# Altium project ESP32-Sense Kit Motherboard.PrjPcb
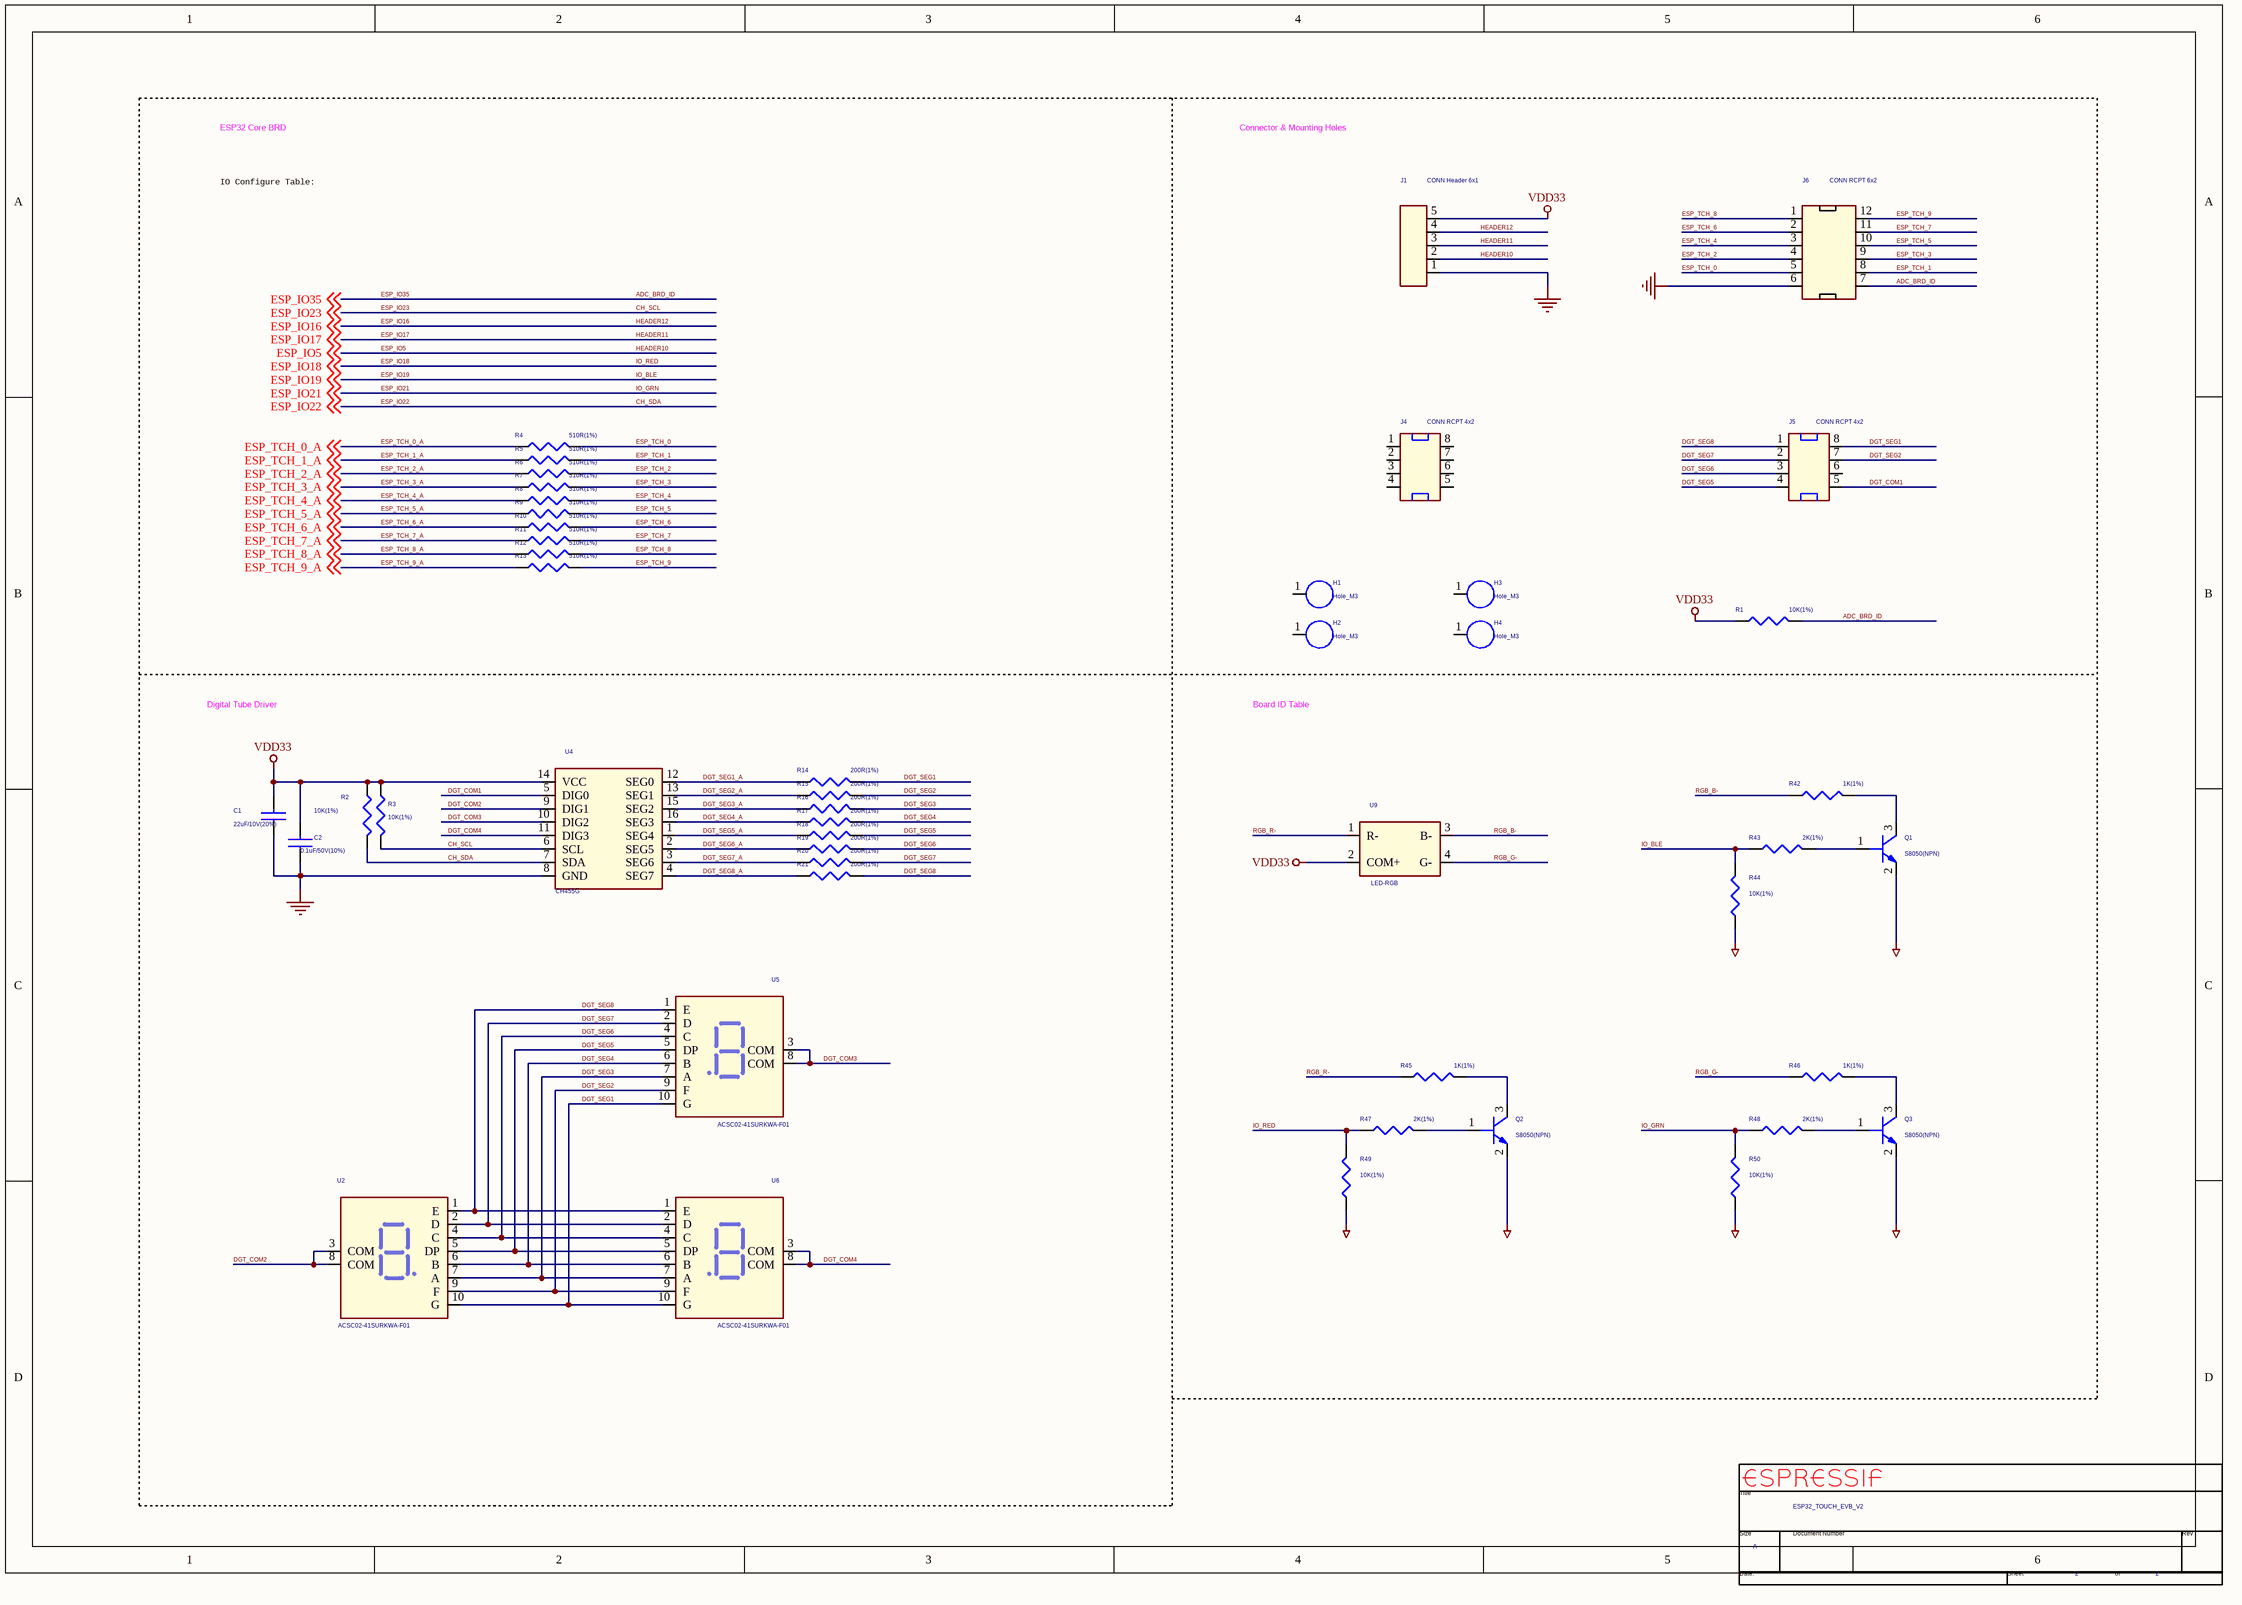
[diagram p0: 02 ESP32 MAIN_B.SchDoc]
2 sheets, 72 parts. Net scope: global (net labels, ports and power ports of the same name join across sheets).
Board file: ESP32-Sense Kit Motherboard.PcbDoc
Sheets:
  02 ESP32 MAIN_B.SchDoc
  01 ESP32 MAIN_A.SchDoc

## Sheet 02 ESP32 MAIN_B.SchDoc
size 420 x 297 mm

### Parts
(Parts that share a designator on the sheet are numbered #1, #2 ... from top to bottom, then left to right.)
*#1  Title: ESP32_TOUCH_EVB_V2  Page Size: A  Page Number: 2  (hidden comment: espTitleBlock1)  (graphical)
C1  22uF/10V(20%)  [0603C]
C2  0.1uF/50V(10%)  [0402C]
H1  Hole_M3  [MTGH200C125D-N]
H2  Hole_M3  [MTGH200C125D-N]
H3  Hole_M3  [MTGH200C125D-N]
H4  Hole_M3  [MTGH200C125D-N]
J1  CONN Header 6x1  [CON_5x1_2P54]
J4  CONN RCPT 4x2  [CON_F_4x2_2P00]
J5  CONN RCPT 4x2  [CON_F_4x2_2P00]
J6  CONN RCPT 6x2  [CON_F_6x2_2P00]
Q1  S8050(NPN)  [SOT-23-3]
Q2  S8050(NPN)  [SOT-23-3]
Q3  S8050(NPN)  [SOT-23-3]
R1  10K(1%)  [0402R]
R2  10K(1%)  [0402R]
R3  10K(1%)  [0402R]
R4  510R(1%)  [0402R]
R5  510R(1%)  [0402R]
R6  510R(1%)  [0402R]
R7  510R(1%)  [0402R]
R8  510R(1%)  [0402R]
R9  510R(1%)  [0402R]
R10  510R(1%)  [0402R]
R11  510R(1%)  [0402R]
R12  510R(1%)  [0402R]
R13  510R(1%)  [0402R]
R14  200R(1%)  [0402R]
R15  200R(1%)  [0402R]
R16  200R(1%)  [0402R]
R17  200R(1%)  [0402R]
R18  200R(1%)  [0402R]
R19  200R(1%)  [0402R]
R20  200R(1%)  [0402R]
R21  200R(1%)  [0402R]
R42  1K(1%)  [0402R]
R43  2K(1%)  [0402R]
R44  10K(1%)  [0402R]
R45  1K(1%)  [0402R]
R46  1K(1%)  [0402R]
R47  2K(1%)  [0402R]
R48  2K(1%)  [0402R]
R49  10K(1%)  [0402R]
R50  10K(1%)  [0402R]
U2  ACSC02-41SURKWA-F01  [DG10069]
U4  CH455G  [SOP16-150MIL]
U5  ACSC02-41SURKWA-F01  [DG10069]
U6  ACSC02-41SURKWA-F01  [DG10069]
U9  LED-RGB  [LED3528]

### Nets
GND: C1.1 C2.1 J1.1 J6.6 Q1.2(E) Q2.2(E) Q3.2(E) R44.1 R49.1 R50.1 U4.8(GND)
VDD33: C1.2 C2.2 J1.5 R1.1 R2.1 R3.1 U4.14(VCC) U9.2(COM+)
ADC_BRD_ID: J6.7 R1.2 ; off-sheet ESP_IO35  [also labelled ESP_IO35]
CH_SCL: R3.2 U4.6(SCL) ; off-sheet ESP_IO23  [also labelled ESP_IO23]
CH_SDA: R2.2 U4.7(SDA) ; off-sheet ESP_IO22  [also labelled ESP_IO22]
DGT_COM1: J5.5 U4.5(DIG0)
DGT_COM2: U2.3(COM) U2.8(COM) U4.9(DIG1)
DGT_COM3: U4.10(DIG2) U5.3(COM) U5.8(COM)
DGT_COM4: U4.11(DIG3) U6.3(COM) U6.8(COM)
DGT_SEG1: J5.8 R14.2 U2.10(G) U5.10(G) U6.10(G)
DGT_SEG1_A: R14.1 U4.12(SEG0)
DGT_SEG2: J5.7 R15.2 U2.9(F) U5.9(F) U6.9(F)
DGT_SEG2_A: R15.1 U4.13(SEG1)
DGT_SEG3: R16.2 U2.7(A) U5.7(A) U6.7(A)
DGT_SEG3_A: R16.1 U4.15(SEG2)
DGT_SEG4: R17.2 U2.6(B) U5.6(B) U6.6(B)
DGT_SEG4_A: R17.1 U4.16(SEG3)
DGT_SEG5: J5.4 R18.2 U2.5(DP) U5.5(DP) U6.5(DP)
DGT_SEG5_A: R18.1 U4.1(SEG4)
DGT_SEG6: J5.3 R19.2 U2.4(C) U5.4(C) U6.4(C)
DGT_SEG6_A: R19.1 U4.2(SEG5)
DGT_SEG7: J5.2 R20.2 U2.2(D) U5.2(D) U6.2(D)
DGT_SEG7_A: R20.1 U4.3(SEG6)
DGT_SEG8: J5.1 R21.2 U2.1(E) U5.1(E) U6.1(E)
DGT_SEG8_A: R21.1 U4.4(SEG7)
ESP_IO5: J1.2 ; off-sheet ESP_IO5  [also labelled HEADER10]
ESP_IO16: J1.4 ; off-sheet ESP_IO16  [also labelled HEADER12]
ESP_IO17: J1.3 ; off-sheet ESP_IO17  [also labelled HEADER11]
ESP_IO18: R47.1 R49.2 ; off-sheet ESP_IO18  [also labelled IO_RED]
ESP_IO19: R43.1 R44.2 ; off-sheet ESP_IO19  [also labelled IO_BLE]
ESP_IO21: R48.1 R50.2 ; off-sheet ESP_IO21  [also labelled IO_GRN]
ESP_TCH_0: J6.5 R4.2
ESP_TCH_0_A: R4.1 ; off-sheet ESP_TCH_0_A
ESP_TCH_1: J6.8 R5.2
ESP_TCH_1_A: R5.1 ; off-sheet ESP_TCH_1_A  [project net ESP_GPIO0]
ESP_TCH_2: J6.4 R6.2
ESP_TCH_2_A: R6.1 ; off-sheet ESP_TCH_2_A
ESP_TCH_3: J6.9 R7.2
ESP_TCH_3_A: R7.1 ; off-sheet ESP_TCH_3_A
ESP_TCH_4: J6.3 R8.2
ESP_TCH_4_A: R8.1 ; off-sheet ESP_TCH_4_A
ESP_TCH_5: J6.10 R9.2
ESP_TCH_5_A: R9.1 ; off-sheet ESP_TCH_5_A
ESP_TCH_6: J6.2 R10.2
ESP_TCH_6_A: R10.1 ; off-sheet ESP_TCH_6_A
ESP_TCH_7: J6.11 R11.2
ESP_TCH_7_A: R11.1 ; off-sheet ESP_TCH_7_A
ESP_TCH_8: J6.1 R12.2
ESP_TCH_8_A: R12.1 ; off-sheet ESP_TCH_8_A
ESP_TCH_9: J6.12 R13.2
ESP_TCH_9_A: R13.1 ; off-sheet ESP_TCH_9_A
RGB_B-: R42.1 U9.3(B-)
RGB_G-: R46.1 U9.4(G-)
RGB_R-: R45.1 U9.1(R-)
NetQ1_1: Q1.1(B) R43.2
NetQ1_3: Q1.3(C) R42.2
NetQ2_1: Q2.1(B) R47.2
NetQ2_3: Q2.3(C) R45.2
NetQ3_1: Q3.1(B) R48.2
NetQ3_3: Q3.3(C) R46.2

Not connected (* = marked no-connect by the designer): H1 1; H2 1; H3 1; H4 1; J4 1 2 3 4 5 6 7 8; J5 6

### Notes on the sheet
- IO Configure Table:
- ESP32 Core BRD
- Connector & Mounting Holes
- Digital Tube Driver
- Board ID Table
- (in symbol espTitleBlock1) Title; Size; Document Number; Rev; Date:; Sheet; of

### Library data of the parts
C1 C2 = CAP NP
H1-H4 = CON1_0
J1 = 12 HEADER_12
J4 J5 = 12 HEADER_5
J6 = CONN RCPT 10x2_2
Q1-Q3 = NPN BCE_0: PspiceTemplate: Q^@REFDES %C %B %E
R1 R4-R21 R43 R47 R48 = RESISTOR
R2 R3 R42 R45 R46 = RESISTOR_0
R44 R49 R50 = RESISTOR_0: SIGNAL_MODEL: DEFAULT_RESISTOR_10000OHM_1_2
U2 U5 U6 = Digital_Tube: Part Number: ACSC02-41SURKWA-F01
U4 = 74HC138_4
*#1 = espTitleBlock1: Page Create Date: March  8, 1995; Page Count: 2

## Sheet 01 ESP32 MAIN_A.SchDoc
size 420 x 297 mm
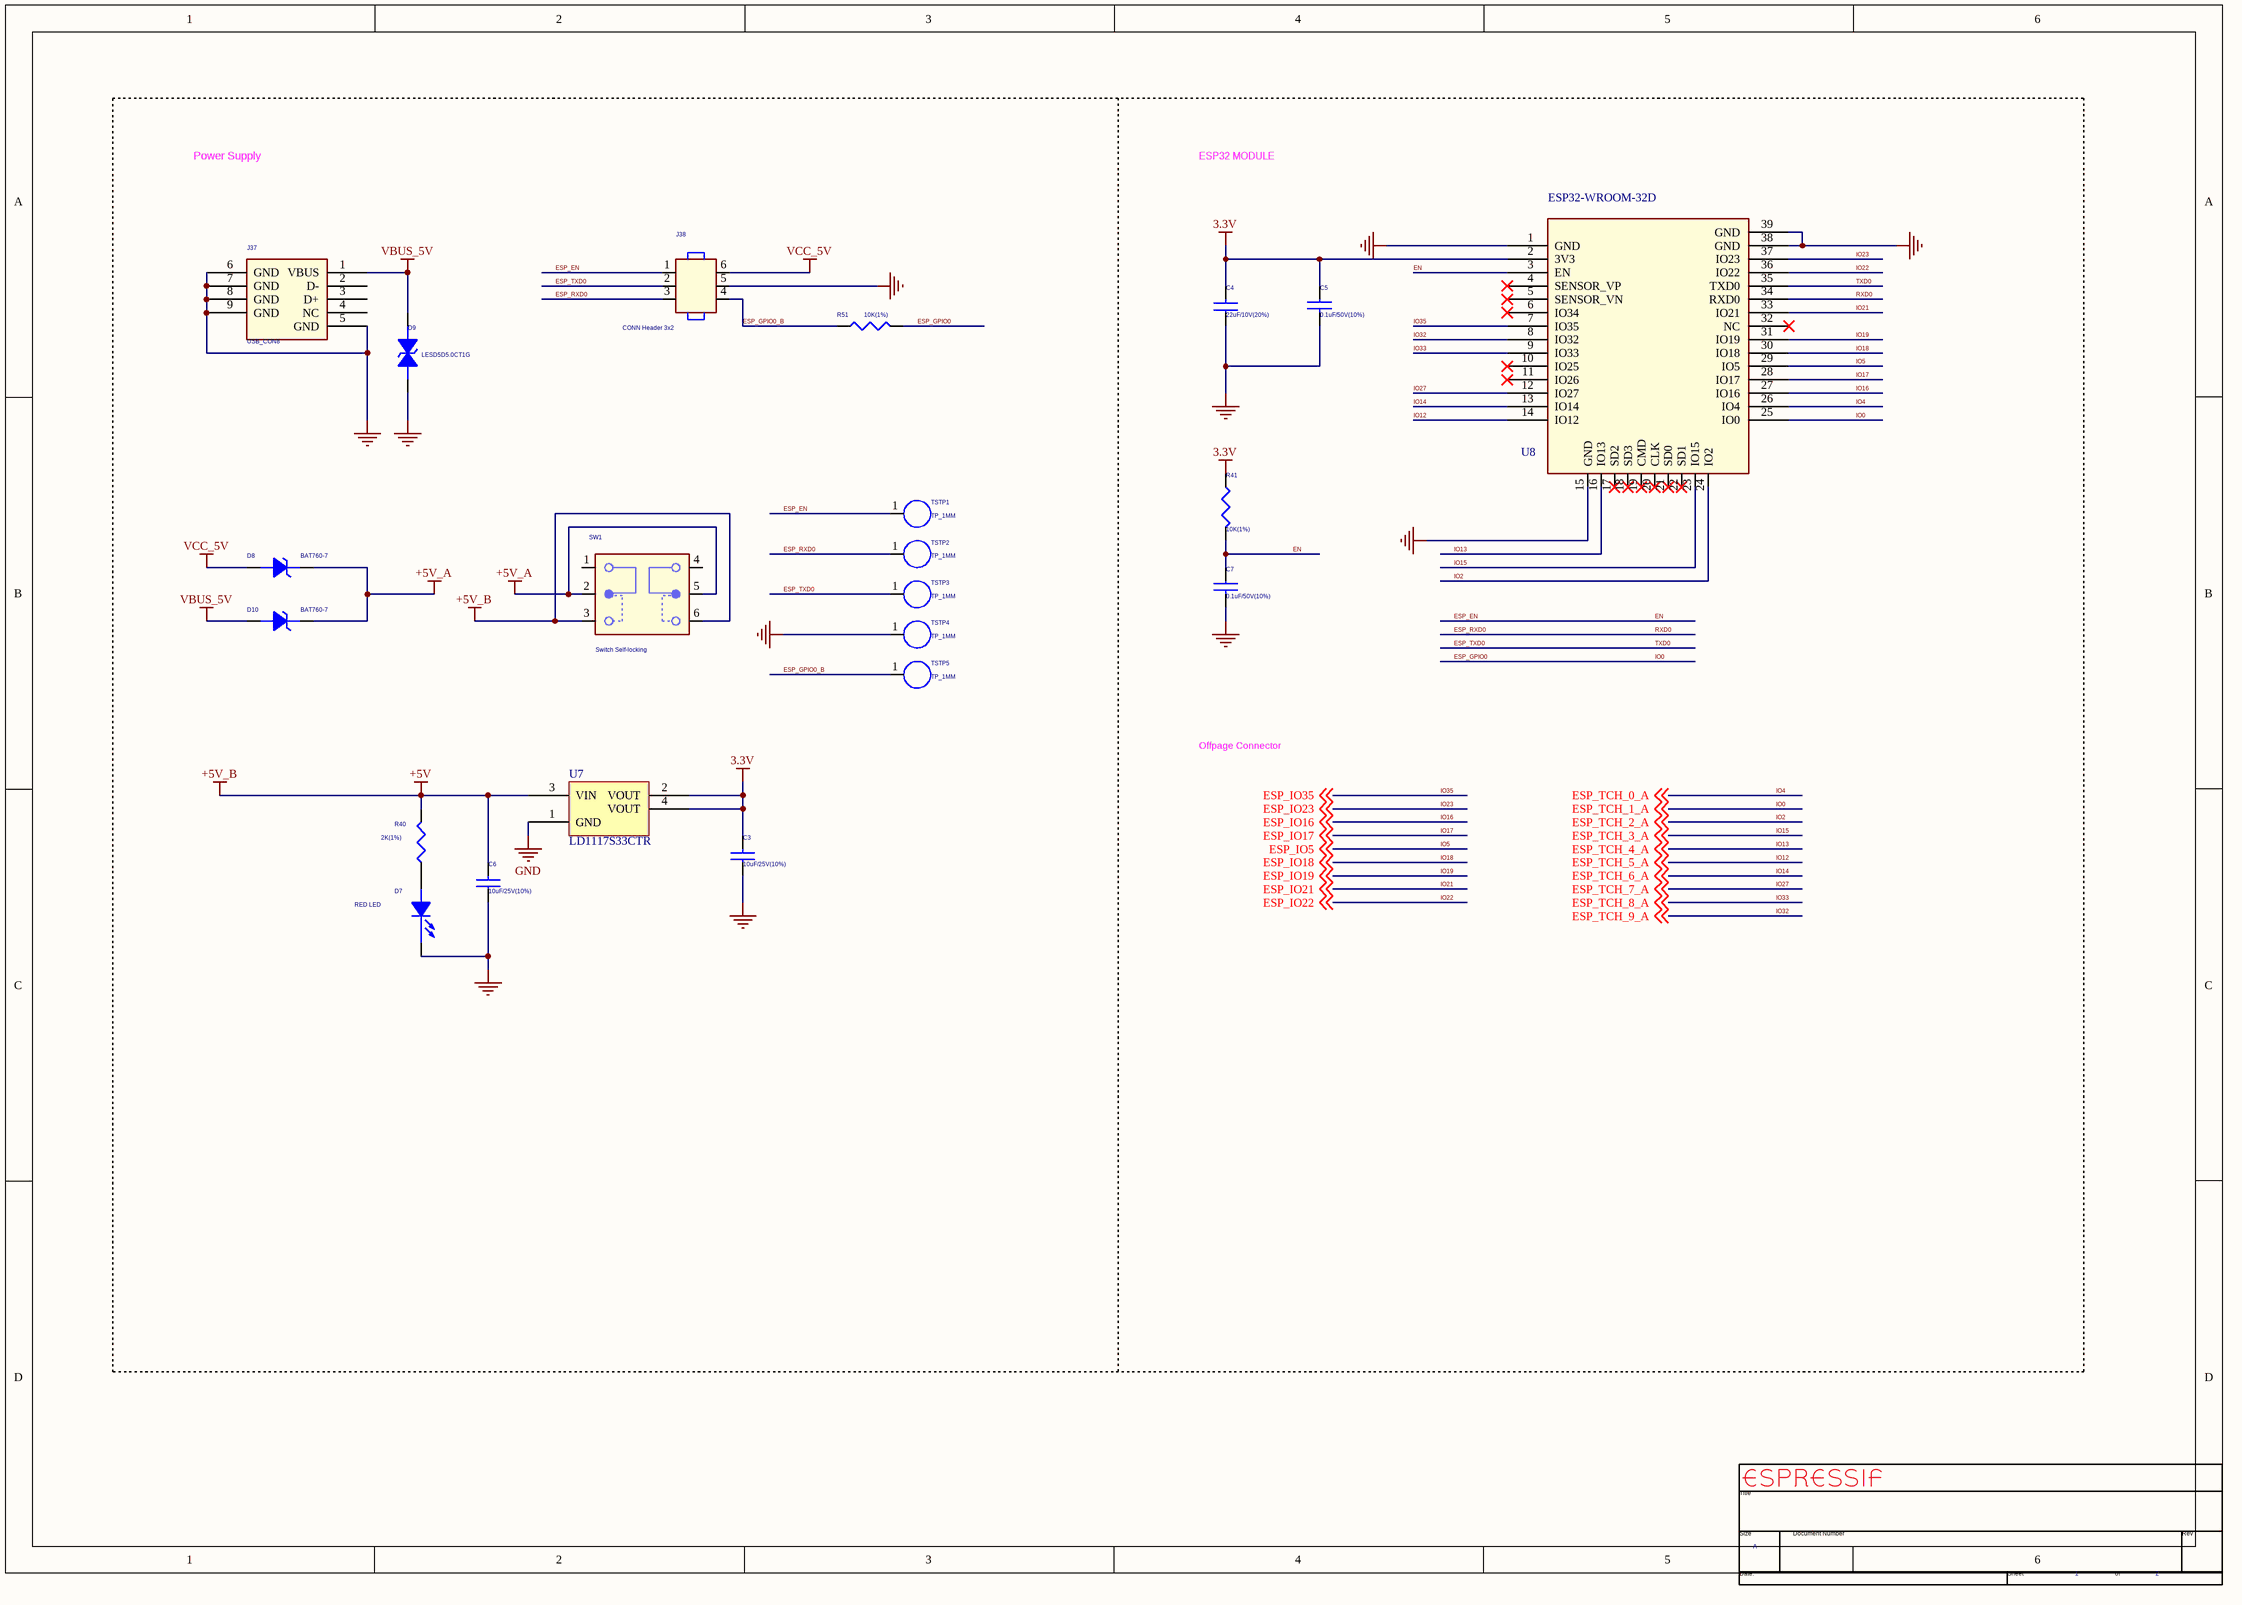
[diagram p1: 01 ESP32 MAIN_A.SchDoc]

### Parts
(Parts that share a designator on the sheet are numbered #1, #2 ... from top to bottom, then left to right.)
*#2  Page Size: A  Page Number: 1  Page Count: 2  (hidden comment: espTitleBlock1)  (graphical)
C3  10uF/25V(10%)  [0603C]
C4  22uF/10V(20%)  [C0603]
C5  0.1uF/50V(10%)  [C0402]
C6  10uF/25V(10%)  [0603C]
C7  0.1uF/50V(10%)  [C0402]
D7  RED LED  [0603D/A]
D8  BAT760-7  [SOD-323]
D9  LESD5D5.0CT1G  [ESD0402]
D10  BAT760-7  [SOD-323]
J37  USB_CON8  [USB_5P]
J38  CONN Header 3x2  [DC3-6P-1P27]
R40  2K(1%)  [0402R]
R41  10K(1%)  [0402R]
R51  10K(1%)  [0402R]
SW1  Switch Self-locking  [SW5858-6]
TSTP1  TP_1MM  [TP_1MM]
TSTP2  TP_1MM  [TP_1MM]
TSTP3  TP_1MM  [TP_1MM]
TSTP4  TP_1MM  [TP_1MM]
TSTP5  TP_1MM  [TP_1MM]
U7  LD1117S33CTR  [ST SOT-223]
U8  ESP32-WROOM-32D  [*MODULE_ESP32-WROOM-32D]

### Nets
3.3V: C3.2 C4.2 C5.1 R41.1 U7.2(VOUT) U7.4(VOUT) U8.2(3V3)
+5V: C6.2 R40.1 SW1.3(NO1) SW1.6(NO2) U7.3(VIN)  [also labelled +5V_B]
+5V_A: D8.1 D10.1 SW1.2(COM1) SW1.5(COM2)
GND: C3.1 C4.1 C5.2 C6.1 C7.2 D7.2(CATHODE) D9.2 J37.5(GND) J37.6(GND) J37.7(GND) J37.8(GND) J37.9(GND) J38.5 TSTP4.1 U7.1(GND) U8.1(GND) U8.15(GND) U8.38(GND) U8.39(GND)
VBUS_5V: D9.1 D10.2 J37.1(VBUS)
VCC_5V: D8.2 J38.6
EN: C7.1 J38.1 R41.2 TSTP1.1 U8.3(EN)  [also labelled ESP_EN]
ESP_GPIO0: R51.2 U8.25(IO0) ; off-sheet ESP_TCH_1_A  [also labelled ESP_TCH_1_A, IO0]
ESP_GPIO0_B: J38.4 R51.1 TSTP5.1
ESP_IO5: U8.29(IO5) ; off-sheet ESP_IO5  [also labelled IO5]
ESP_IO16: U8.27(IO16) ; off-sheet ESP_IO16  [also labelled IO16]
ESP_IO17: U8.28(IO17) ; off-sheet ESP_IO17  [also labelled IO17]
ESP_IO18: U8.30(IO18) ; off-sheet ESP_IO18  [also labelled IO18]
ESP_IO19: U8.31(IO19) ; off-sheet ESP_IO19  [also labelled IO19]
ESP_IO21: U8.33(IO21) ; off-sheet ESP_IO21  [also labelled IO21]
ESP_IO22: U8.36(IO22) ; off-sheet ESP_IO22  [also labelled IO22]  [project net CH_SDA]
ESP_IO23: U8.37(IO23) ; off-sheet ESP_IO23  [also labelled IO23]  [project net CH_SCL]
ESP_IO35: U8.7(IO35) ; off-sheet ESP_IO35  [also labelled IO35]  [project net ADC_BRD_ID]
ESP_RXD0: J38.3 TSTP2.1 U8.34(RXD0)  [also labelled RXD0]
ESP_TCH_0_A: U8.26(IO4) ; off-sheet ESP_TCH_0_A  [also labelled IO4]
ESP_TCH_2_A: U8.24(IO2) ; off-sheet ESP_TCH_2_A  [also labelled IO2]
ESP_TCH_3_A: U8.23(IO15) ; off-sheet ESP_TCH_3_A  [also labelled IO15]
ESP_TCH_4_A: U8.16(IO13) ; off-sheet ESP_TCH_4_A  [also labelled IO13]
ESP_TCH_5_A: U8.14(IO12) ; off-sheet ESP_TCH_5_A  [also labelled IO12]
ESP_TCH_6_A: U8.13(IO14) ; off-sheet ESP_TCH_6_A  [also labelled IO14]
ESP_TCH_7_A: U8.12(IO27) ; off-sheet ESP_TCH_7_A  [also labelled IO27]
ESP_TCH_8_A: U8.9(IO33) ; off-sheet ESP_TCH_8_A  [also labelled IO33]
ESP_TCH_9_A: U8.8(IO32) ; off-sheet ESP_TCH_9_A  [also labelled IO32]
ESP_TXD0: J38.2 TSTP3.1 U8.35(TXD0)  [also labelled TXD0]
NetD7_1: D7.1(ANODE) R40.2

Not connected (* = marked no-connect by the designer): J37 2(D-) 3(D+) 4(NC); SW1 1(NC1) 4(NC2); U8 4(SENSOR_VP)* 5(SENSOR_VN)* 6(IO34)* 10(IO25)* 11(IO26)* 17(SD2)* 18(SD3)* 19(CMD)* 20(CLK)* 21(SD0)* 22(SD1)* 32(NC)*

### Notes on the sheet
- Power Supply
- ESP32 MODULE
- Offpage Connector
- (in symbol espTitleBlock1) Title; Size; Document Number; Rev; Date:; Sheet; of

### Library data of the parts
C3-C7 = CAP NP
D7 = LED_1
D8 D10 = DIODE_POWER
D9 = DIODE BI-DIR TRIG
J37 = CON4_2
J38 = 12 HEADER_9
R40 R41 R51 = RESISTOR_0
SW1 = Switch_selflocking_6p
TSTP1-TSTP5 = CON1_0
U7 = LD1117S33CTR: IC REG LDO 3.3V 0.8A SOT223; Manufacturer: STMicroelectronics; Topology: Positive Fixed; Voltage Dropout: 1.1V @ 800mA; Voltage - Input: Up to 15V; Part Number: LD1117S33CTR; PartId: 7963; Supplier 1: Digi-Key; Supplier Part Number 1: 497-1241-2-ND; ComponentLink1Description: Datasheet; ComponentLink1URL: http://www.st.com/web/en/resource/technical/document/datasheet/CD00000544.pdf; ComponentLink2Description: Digi-Key Listing; ComponentLink2URL: http://www.digikey.com/product-detail/en/LD1117S33CTR/497-1241-2-ND/585765; Price: 0.127; Device Package: TO-261-4, TO-261AA; Voltage - Output: 3.3V; Current - Limit (Min): -; Operating Temperature: -40C ~ 125C
U8 = ESP32-WROOM-32D: IC: SoC; GPIO, I2C, I2S, IR, SD, SDIO, SPI, UART; 2.7Ã·3.6VDC; 20dBm; MF: Espressif Systems; Package: Module Espressif Systems; Price: None; Availability: Unavailable; MP: ESP32-WROOM-32D; SnapEDA_Link: https://www.snapeda.com/parts/ESP32-WROOM-32D/Espressif%20Systems/view-part/?ref=snap; Value: *
*#2 = espTitleBlock1: Page Create Date: March  8, 1995

## Nets that join several sheets
GND: 02 ESP32 MAIN_B (11 pins), 01 ESP32 MAIN_A (19 pins)
ADC_BRD_ID: 02 ESP32 MAIN_B (J6.7 R1.2), 01 ESP32 MAIN_A (U8.7)
CH_SCL: 02 ESP32 MAIN_B (R3.2 U4.6), 01 ESP32 MAIN_A (U8.37)
CH_SDA: 02 ESP32 MAIN_B (R2.2 U4.7), 01 ESP32 MAIN_A (U8.36)
ESP_GPIO0: 02 ESP32 MAIN_B (R5.1), 01 ESP32 MAIN_A (R51.2 U8.25)
ESP_IO5: 02 ESP32 MAIN_B (J1.2), 01 ESP32 MAIN_A (U8.29)
ESP_IO16: 02 ESP32 MAIN_B (J1.4), 01 ESP32 MAIN_A (U8.27)
ESP_IO17: 02 ESP32 MAIN_B (J1.3), 01 ESP32 MAIN_A (U8.28)
ESP_IO18: 02 ESP32 MAIN_B (R47.1 R49.2), 01 ESP32 MAIN_A (U8.30)
ESP_IO19: 02 ESP32 MAIN_B (R43.1 R44.2), 01 ESP32 MAIN_A (U8.31)
ESP_IO21: 02 ESP32 MAIN_B (R48.1 R50.2), 01 ESP32 MAIN_A (U8.33)
ESP_TCH_0_A: 02 ESP32 MAIN_B (R4.1), 01 ESP32 MAIN_A (U8.26)
ESP_TCH_2_A: 02 ESP32 MAIN_B (R6.1), 01 ESP32 MAIN_A (U8.24)
ESP_TCH_3_A: 02 ESP32 MAIN_B (R7.1), 01 ESP32 MAIN_A (U8.23)
ESP_TCH_4_A: 02 ESP32 MAIN_B (R8.1), 01 ESP32 MAIN_A (U8.16)
ESP_TCH_5_A: 02 ESP32 MAIN_B (R9.1), 01 ESP32 MAIN_A (U8.14)
ESP_TCH_6_A: 02 ESP32 MAIN_B (R10.1), 01 ESP32 MAIN_A (U8.13)
ESP_TCH_7_A: 02 ESP32 MAIN_B (R11.1), 01 ESP32 MAIN_A (U8.12)
ESP_TCH_8_A: 02 ESP32 MAIN_B (R12.1), 01 ESP32 MAIN_A (U8.9)
ESP_TCH_9_A: 02 ESP32 MAIN_B (R13.1), 01 ESP32 MAIN_A (U8.8)